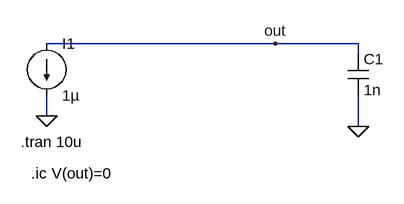
[diagram p0: schematic quiz_q13.asc]
quiz_q13.asc, the LTspice schematic file:
Version 4
SHEET 1 880 680
WIRE 480 80 128 80
WIRE 608 80 480 80
WIRE 608 96 608 80
WIRE 128 192 128 160
WIRE 608 208 608 160
FLAG 128 192 0
FLAG 608 208 0
FLAG 480 80 out
SYMBOL cap 592 96 R0
SYMATTR InstName C1
SYMATTR Value 1n
SYMBOL current 128 80 R0
WINDOW 123 0 0 Left 0
WINDOW 39 0 0 Left 0
SYMATTR InstName I1
SYMATTR Value 1µ
TEXT 88 232 Left 2 !.tran 10u
TEXT 104 280 Left 2 !.ic V(out)=0

The netlist it stands for:
* quiz_q13.asc
C1 out 0 1n
I1 out 0 1µ
.tran 10u
.ic V(out)=0
.backanno
.end